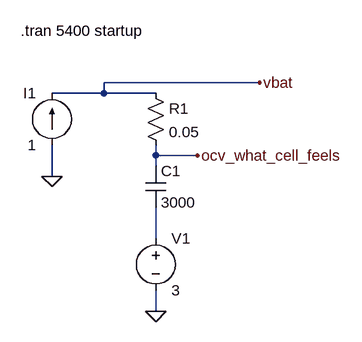
[diagram p0: schematic Battery_test_Crosses_4V.asc]
Battery_test_Crosses_4V.asc, the LTspice schematic file:
Version 4.1
SHEET 1 880 680
WIRE -368 -768 -608 -768
WIRE -608 -752 -608 -768
WIRE -608 -752 -688 -752
WIRE -528 -752 -608 -752
WIRE -528 -656 -528 -672
WIRE -464 -656 -528 -656
WIRE -528 -640 -528 -656
WIRE -688 -624 -688 -672
WIRE -528 -528 -528 -576
WIRE -528 -416 -528 -448
FLAG -528 -416 0
FLAG -368 -768 vbat
FLAG -464 -656 ocv_what_cell_feels
FLAG -688 -624 0
SYMBOL current -688 -672 R180
WINDOW 0 24 80 Left 2
WINDOW 3 24 0 Left 2
SYMATTR InstName I1
SYMATTR Value 1
SYMBOL res -544 -768 R0
SYMATTR InstName R1
SYMATTR Value 0.05
SYMBOL cap -544 -640 R0
SYMATTR InstName C1
SYMATTR Value 3000
SYMBOL voltage -528 -544 R0
SYMATTR InstName V1
SYMATTR Value 3
TEXT -736 -848 Left 2 !.tran 5400 startup

The netlist it stands for:
* Battery_test_Crosses_4V.asc
I1 0 vbat 1
R1 vbat ocv_what_cell_feels 0.05
C1 ocv_what_cell_feels N001 3000
V1 N001 0 3
.tran 5400 startup
.backanno
.end